# Altium schematic sheet CPU Board Connectors.SchDoc
size A4
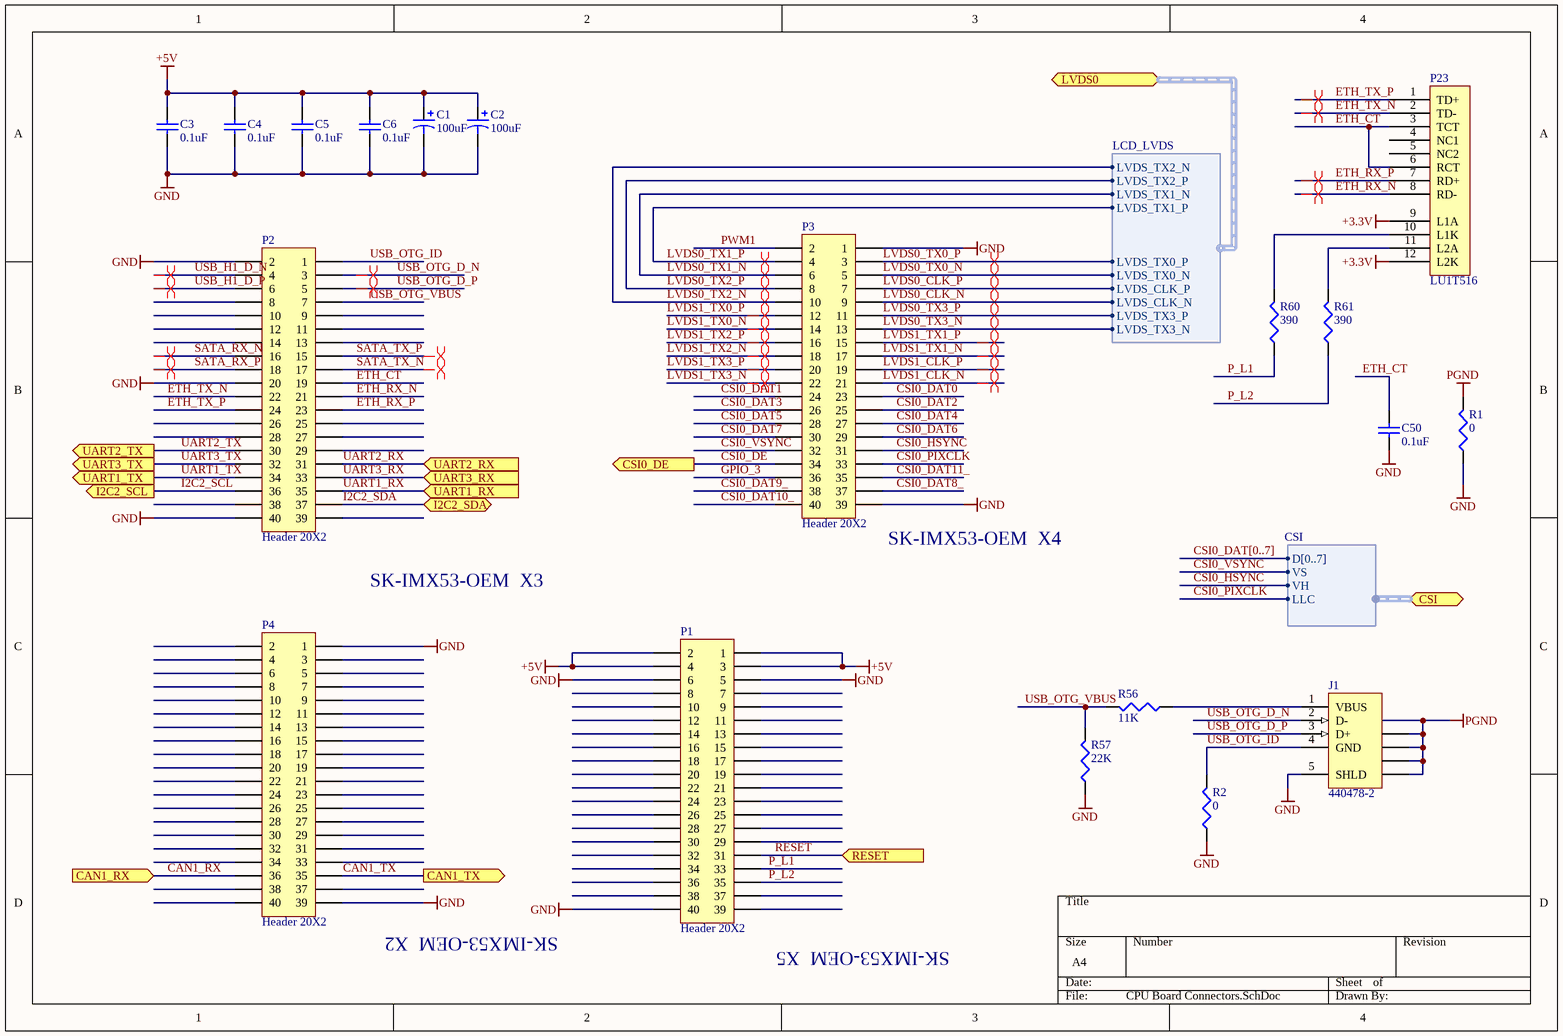
[diagram p0: CPU Board Connectors.SchDoc]

## Parts
C1  100uF  [6032]
C2  100uF  [6032]
C3  0.1uF  [2012[0805]]
C4  0.1uF  [2012[0805]]
C5  0.1uF  [2012[0805]]
C6  0.1uF  [2012[0805]]
C50  0.1uF  [2012[0805]]
J1  440478-2  [440478]
P1  Header 20X2  [HDR2X20_F]
P2  Header 20X2  [HDR2X20_F]
P3  Header 20X2  [HDR2X20_F]
P4  Header 20X2  [HDR2X20_F]
P23  LU1T516  [LU1T516]
R1  0  [R2012[0805]]
R2  0  [R2012[0805]]
R56  11K  [R2012[0805]]
R57  22K  [R2012[0805]]
R60  390  [R2012[0805]]
R61  390  [R2012[0805]]

## Ports
CAN1_RX (in), CAN1_TX (out), CSI0_DE (out), CSI (harness CSI), I2C2_SCL (out), I2C2_SDA (bidir), LVDS0 (harness LCD_LVDS), RESET (in), UART1_RX (in), UART1_TX (out), UART2_RX (in), UART2_TX (out), UART3_RX (in), UART3_TX (out)

## Harnesses
CSI: D[0..7], VS, VH, LLC
LCD_LVDS: LVDS_TX0_P, LVDS_TX0_N, LVDS_TX1_P, LVDS_TX1_N, LVDS_TX2_P, LVDS_TX2_N, LVDS_CLK_P, LVDS_CLK_N, LVDS_TX3_P, LVDS_TX3_N

## Nets
+3.3V: P23.9(L1A) P23.12(L2K)
+5V: C1.1 C2.1 C3.2 C4.2 C5.2 C6.2 P1.1 P1.2 P1.3 P1.4
GND: C1.2 C2.2 C3.1 C4.1 C5.1 C6.1 C50.2 J1.5(SHLD) P1.5 P1.6 P1.40 P2.2 P2.20 P2.40 P3.1 P3.39 P4.1 P4.39 R1.1 R2.1 R57.1
PGND: J1.6(SHLD) J1.7(SHLD) J1.8(SHLD) J1.9(SHLD) R1.2
CAN1_RX: P4.36 ; port CAN1_RX
CAN1_TX: P4.35 ; port CAN1_TX
CSI0_DAT0: P3.23
CSI0_DAT1: P3.24
CSI0_DAT2: P3.25
CSI0_DAT3: P3.26
CSI0_DAT4: P3.27
CSI0_DAT5: P3.28
CSI0_DAT6: P3.29
CSI0_DAT7: P3.30
CSI0_DAT8_: P3.37
CSI0_DAT9_: P3.38
CSI0_DAT10_: P3.40
CSI0_DAT11_: P3.35
CSI0_DE: P3.34 ; port CSI0_DE
CSI0_HSYNC: P3.31 ; port CSI.VH
CSI0_PIXCLK: P3.33 ; port CSI.LLC
CSI0_VSYNC: P3.32 ; port CSI.VS
ETH_CT: C50.1 P2.19 P23.3(TCT) P23.6(RCT)
ETH_RX_N: P2.21 P23.8(RD-)
ETH_RX_P: P2.23 P23.7(RD+)
ETH_TX_N: P2.22 P23.2(TD-)
ETH_TX_P: P2.24 P23.1(TD+)
GPIO_3: P3.36
I2C2_SCL: P2.36 ; port I2C2_SCL
I2C2_SDA: P2.37 ; port I2C2_SDA
LVDS0_CLK_N: P3.9 ; port LVDS0.LVDS_CLK_N
LVDS0_CLK_P: P3.7 ; port LVDS0.LVDS_CLK_P
LVDS0_TX0_N: P3.5 ; port LVDS0.LVDS_TX0_N
LVDS0_TX0_P: P3.3 ; port LVDS0.LVDS_TX0_P
LVDS0_TX1_N: P3.6 ; port LVDS0.LVDS_TX1_N
LVDS0_TX1_P: P3.4 ; port LVDS0.LVDS_TX1_P
LVDS0_TX2_N: P3.10 ; port LVDS0.LVDS_TX2_N
LVDS0_TX2_P: P3.8 ; port LVDS0.LVDS_TX2_P
LVDS0_TX3_N: P3.13 ; port LVDS0.LVDS_TX3_N
LVDS0_TX3_P: P3.11 ; port LVDS0.LVDS_TX3_P
LVDS1_CLK_N: P3.21
LVDS1_CLK_P: P3.19
LVDS1_TX0_N: P3.14
LVDS1_TX0_P: P3.12
LVDS1_TX1_N: P3.17
LVDS1_TX1_P: P3.15
LVDS1_TX2_N: P3.18
LVDS1_TX2_P: P3.16
LVDS1_TX3_N: P3.22
LVDS1_TX3_P: P3.20
P_L1: P1.33 R60.1
P_L2: P1.35 R61.1
PWM1: P3.2
RESET: P1.31 ; port RESET
SATA_RX_N: P2.16
SATA_RX_P: P2.18
SATA_TX_N: P2.17
SATA_TX_P: P2.15
UART1_RX: P2.35 ; port UART1_RX
UART1_TX: P2.34 ; port UART1_TX
UART2_RX: P2.31 ; port UART2_RX
UART2_TX: P2.30 ; port UART2_TX
UART3_RX: P2.33 ; port UART3_RX
UART3_TX: P2.32 ; port UART3_TX
USB_H1_D_N: P2.4
USB_H1_D_P: P2.6
USB_OTG_D_N: J1.2(D-) P2.3
USB_OTG_D_P: J1.3(D+) P2.5
USB_OTG_ID: J1.4(GND) P2.1 R2.2
USB_OTG_VBUS: P2.7 R56.2 R57.2
NetJ1_1: J1.1(VBUS) R56.1
NetP23_10: P23.10(L1K) R60.2
NetP23_11: P23.11(L2A) R61.2

Not connected (* = marked no-connect by the designer): P1 7 8 9 10 11 12 13 14 15 16 17 18 19 20 21 22 23 24 25 26 27 28 29 30 32 34 36 37 38 39; P2 8 9 10 11 12 13 14 25 26 27 28 29 38 39; P4 2 3 4 5 6 7 8 9 10 11 12 13 14 15 16 17 18 19 20 21 22 23 24 25 26 27 28 29 30 31 32 33 34 37 38 40; P23 4(NC1) 5(NC2)

## Buses and harness runs
bus CSI0_DAT[0..7]

## Layout directives
differential pair: ETH_RX_N, ETH_RX_P, ETH_TX_N, ETH_TX_P, LVDS0_CLK_N, LVDS0_CLK_P, LVDS0_TX0_N, LVDS0_TX0_P, LVDS0_TX1_N, LVDS0_TX1_P, LVDS0_TX2_N, LVDS0_TX2_P, LVDS0_TX3_N, LVDS0_TX3_P, LVDS1_CLK_N, LVDS1_CLK_P, LVDS1_TX0_N, LVDS1_TX0_P, LVDS1_TX1_N, LVDS1_TX1_P, LVDS1_TX2_N, LVDS1_TX2_P, LVDS1_TX3_N, LVDS1_TX3_P, SATA_RX_N, SATA_RX_P, SATA_TX_N, SATA_TX_P, USB_H1_D_N, USB_H1_D_P, USB_OTG_D_N, USB_OTG_D_P

## Notes on the sheet
- (near P3) SK-IMX53-OEM  X4
- SK-IMX53-OEM  X3
- (near P4) SK-IMX53-OEM  X2
- (near P1) SK-IMX53-OEM  X5

## Library data of the parts
C1 C2 = 893D225X0025C2: Tantamount Built-In-Fuse Miniature, Molded-Case Solid Tantalum Chip Capacitor: 2.2uF, 20% Tolerance, 25 WVDC @ +85°C, Surge = 32V; Note: See Data Sheet for full range of components; Published: 19-Mar-2004; DatasheetDocument: 04-Feb-2003; PackageReference: 6032; Publisher: Altium Limited; Code_JEITA: 6032; ComponentLink1Description: Manufacturer Link; ComponentLink1URL: http://www.vishay.com/; ComponentLink2Description: Datasheet; ComponentLink2URL: http://www.vishay.com/docs/40008/893d.pdf; Value: 100uF
C3-C6 C50 = C0805: Ceramic Chip Capacitor - Standard; Note: Footprint corresponds to dimensions for bulk cassette packaging. This case size has tightened tolerances.; Published: 17-Jul-2002; LatestRevisionDate: 19-Mar-2004; LatestRevisionNote: Silkscreen size reduced.; DatasheetDocument: Mar-2001; PackageDocument: Mar-2001; PackageReference: 0805; Publisher: Altium Limited; Code_JEITA: 0805; Code_IPC: 2012[0805]; ComponentLink1Description: Manufacturer Link; ComponentLink1URL: http://www.kemet.com/; ComponentLink2Description: Datasheet; ComponentLink2URL: http://www.kemet.com/kemet/web/homepage/kechome.nsf/vapubfilesname/F3102TA.pdf/$file/F3102TA.pdf; Value: 0.1uF
J1 = 440478-2: USB 2.0, Right Angle, SMT, A Type, Receptacle, 5 Position, Black; ContactMaterial: Phosphor Bronze; ContactPlating: Gold (30) over Nickel; PCB_Layout: Complies with manufacturer's recommendation.; DrillSize: Corresponds to nominal value.; PanelGround: Without; Published: 15-Jul-2004; DatasheetDocument: 15-Nov-2002; PackageDocument: 15-Nov-2002; PackageReference: 440478; Publisher: Altium Limited; HousingMaterial: Thermoplastic; ComponentLink1Description: Manufacturer Link; ComponentLink1URL: http://www.tycoelectronics.com/; ComponentLink2Description: Packaging Specification; ComponentLink2URL: http://ecommas.tycoelectronics.com/commerce/DocumentDelivery/DDEController?Action=showdoc&DocId=Customer+Drawing%7F440478%7FB%7Fpdf%7FEnglish%7FC_440478_B.pdf
P1-P4 = Header 20X2: Header, 20-Pin, Dual row; LatestRevisionDate: 17-Jul-2002; LatestRevisionNote: Re-released for DXP Platform.; Publisher: Altium Limited
R1 R2 R56 R57 R60 R61 = R0805: Published: 8-Jun-2000; LatestRevisionDate: 29-May-2009; LatestRevisionNote: IPC-7351 Footprint Added.; PackageReference: J1-0603; Publisher: Altium Limited; PackageDescription: Chip Resistor
  R1 R2: Value: 0
  R56: Value: 11K
  R57: Value: 22K
  R60 R61: Value: 390